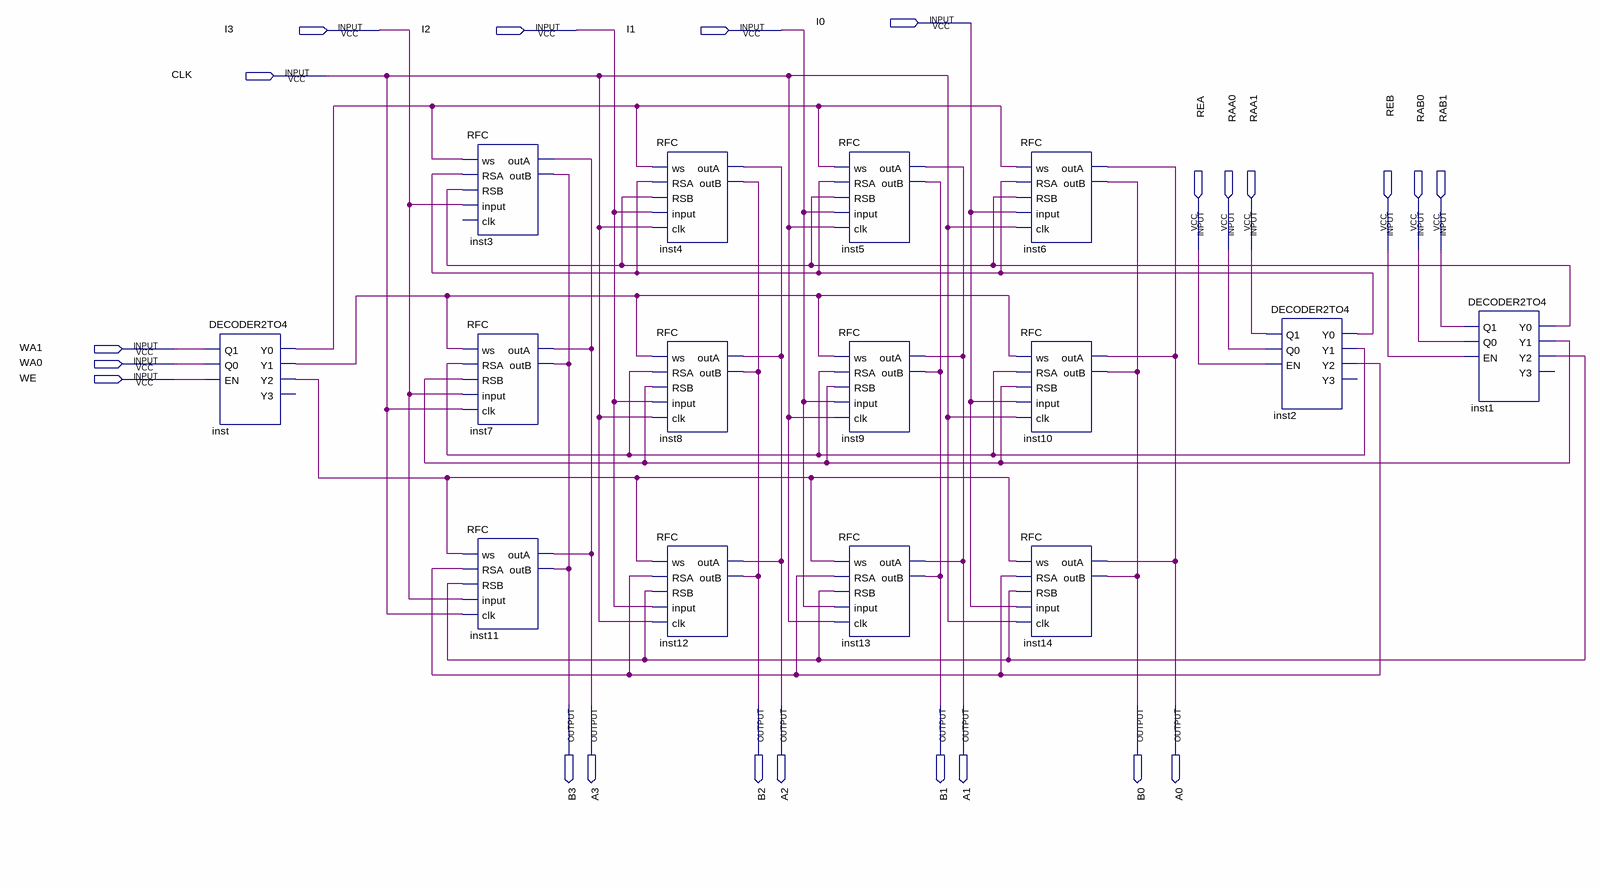
[diagram p0: schematic sheet]
// Quartus schematic RES.bdf as structural Verilog: 15 symbols, 22 pins
module RES (
  input  I0,
  input  I3,
  input  I2,
  input  I1,
  input  CLK,
  input  REA,
  input  RAA0,
  input  RAA1,
  input  REB,
  input  RAB0,
  input  RAB1,
  input  WA1,
  input  WA0,
  input  WE,
  output B3,
  output A3,
  output B2,
  output A2,
  output B1,
  output A1,
  output B0,
  output A0
);

  wire inst1_y0, inst1_y1, inst1_y2, inst2_y0, inst2_y1, inst2_y2, inst_y0, inst_y1, inst_y2;

  DECODER2TO4 inst (.Q1(WA1), .Q0(WA0), .EN(WE), .Y0(inst_y0), .Y1(inst_y1), .Y2(inst_y2));  // open: Y3
  RFC inst3 (.ws(inst_y0), .RSA(inst2_y0), .RSB(inst1_y0), .\input (I3), .outA(A3), .outB(B3));  // open: clk
  RFC inst7 (.ws(inst_y1), .RSA(inst2_y1), .RSB(inst1_y1), .\input (I3), .clk(CLK), .outA(A3), .outB(B3));
  RFC inst11 (.ws(inst_y2), .RSA(inst2_y2), .RSB(inst1_y2), .\input (I3), .clk(CLK), .outA(A3), .outB(B3));
  RFC inst4 (.ws(inst_y0), .RSA(inst2_y0), .RSB(inst1_y0), .\input (I2), .clk(CLK), .outA(A2), .outB(B2));
  RFC inst8 (.ws(inst_y1), .RSA(inst2_y1), .RSB(inst1_y1), .\input (I2), .clk(CLK), .outA(A2), .outB(B2));
  RFC inst12 (.ws(inst_y2), .RSA(inst2_y2), .RSB(inst1_y2), .\input (I2), .clk(CLK), .outA(A2), .outB(B2));
  RFC inst5 (.ws(inst_y0), .RSA(inst2_y0), .RSB(inst1_y0), .\input (I1), .clk(CLK), .outA(A1), .outB(B1));
  RFC inst9 (.ws(inst_y1), .RSA(inst2_y1), .RSB(inst1_y1), .\input (I1), .clk(CLK), .outA(A1), .outB(B1));
  RFC inst13 (.ws(inst_y2), .RSA(inst2_y2), .RSB(inst1_y2), .\input (I1), .clk(CLK), .outA(A1), .outB(B1));
  RFC inst6 (.ws(inst_y0), .RSA(inst2_y0), .RSB(inst1_y0), .\input (I0), .clk(CLK), .outA(A0), .outB(B0));
  RFC inst10 (.ws(inst_y1), .RSA(inst2_y1), .RSB(inst1_y1), .\input (I0), .clk(CLK), .outA(A0), .outB(B0));
  RFC inst14 (.ws(inst_y2), .RSA(inst2_y2), .RSB(inst1_y2), .\input (I0), .clk(CLK), .outA(A0), .outB(B0));
  DECODER2TO4 inst2 (.Q1(RAA1), .Q0(RAA0), .EN(REA), .Y0(inst2_y0), .Y1(inst2_y1), .Y2(inst2_y2));  // open: Y3
  DECODER2TO4 inst1 (.Q1(RAB1), .Q0(RAB0), .EN(REB), .Y0(inst1_y0), .Y1(inst1_y1), .Y2(inst1_y2));  // open: Y3
endmodule
